# EAGLE design Dual Horizontal Breakout Module (EAGLE 6.1)
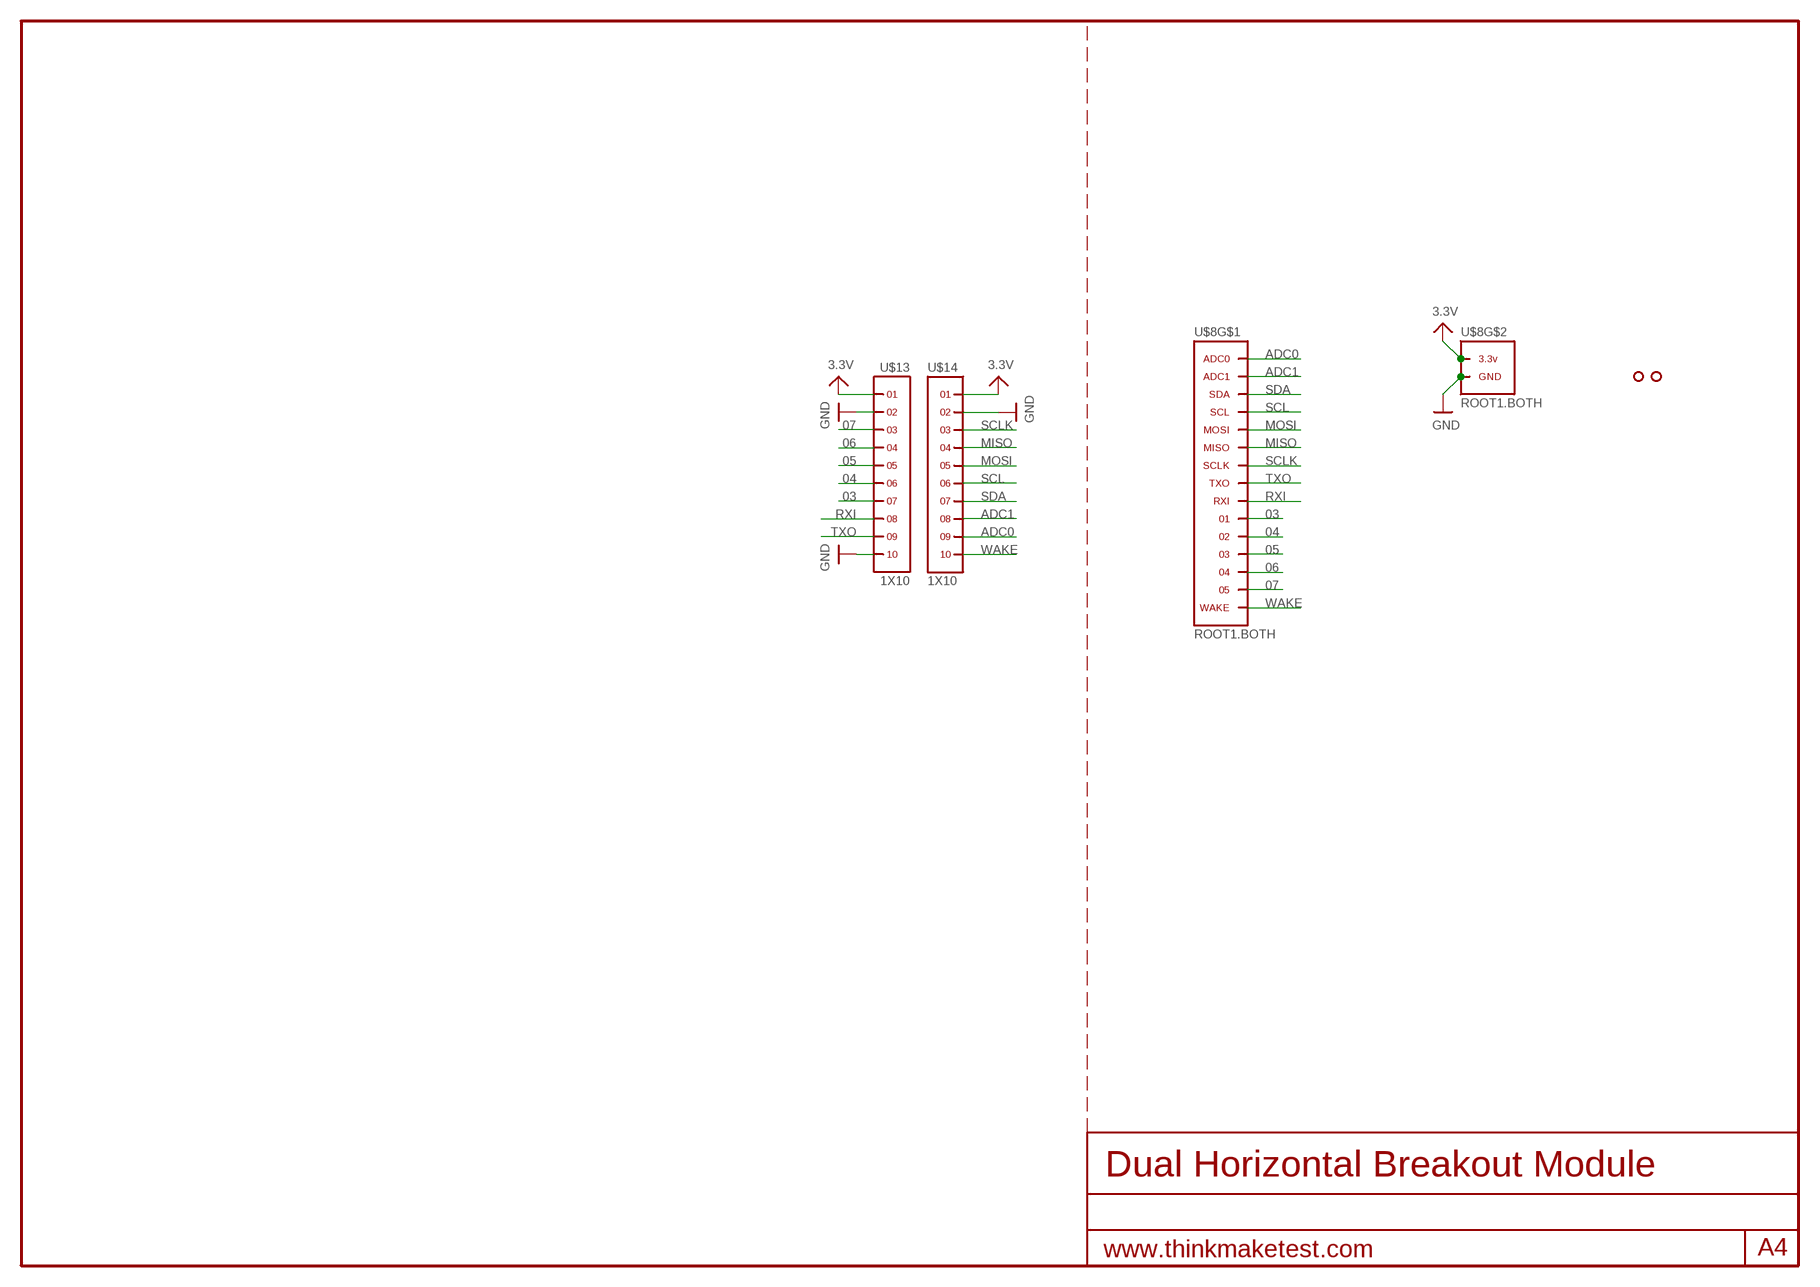
[diagram p0: schematic, sheet 1]

## Parts
U$3  HOLE.2MM  [2MM]
U$4  HOLE.2MM  [2MM]
U$8  ROOT1.BOTH  [ROOT1.BOTH]
U$13  1X10  [1X10]
U$14  1X10  [1X10]

## Nets
03: U$8.03 U$8.03@1 U$8.03@VIA U$13.7
3.3V: U$8.3.3V@1(3.3V) U$8.3.3V@2(3.3V) U$8.3.3V@3(3.3V) U$8.3.3V@4(3.3V) U$8.3.3V@5(3.3V) U$8.3.3V@6(3.3V) U$8.3.3V@7(3.3V) U$8.3.3V@8(3.3V) U$8.3.3V@9(3.3V) U$8.3.3V@10(3.3V) U$8.3.3V@VIA(3.3V) U$13.1 U$14.1
04: U$8.04 U$8.04@1 U$8.04@VIA U$13.6
05: U$8.05 U$8.05@1 U$8.05@VIA U$13.5
06: U$8.06 U$8.06@1 U$8.06@VIA U$13.4
07: U$8.07 U$8.07@1 U$8.07@VIA U$13.3
ADC0: U$8.ADC0 U$8.ADC0@1(ADC0) U$8.ADC0@VIA(ADC0) U$14.9
ADC1: U$8.ADC1 U$8.ADC1@1(ADC1) U$8.ADC1@VIA(ADC1) U$14.8
GND: U$8.GND@1(GND) U$8.GND@2(GND) U$8.GND@3(GND) U$8.GND@4(GND) U$8.GND@5(GND) U$8.GND@6(GND) U$8.GND@7(GND) U$8.GND@8(GND) U$8.GND@9(GND) U$8.GND@10(GND) U$8.GND@11(GND) U$8.GND@12(GND) U$8.GND@13(GND) U$8.GND@14(GND) U$8.GND@15(GND) U$8.GND@16(GND) U$8.GND@17(GND) U$8.GND@18(GND) U$8.GND@19(GND) U$8.GND@20(GND) U$8.GND@VIA(GND) U$13.2 U$13.10 U$14.2
MISO: U$8.MISO U$8.MISO@1(MISO) U$8.MISO@VIA(MISO) U$14.4
MOSI: U$8.MOSI U$8.MOSI@1(MOSI) U$8.MOSI@VIA(MOSI) U$14.5
RXI: U$8.02(RXI) U$8.02@1(RXI) U$8.02@VIA(RXI) U$13.8
SCL: U$8.SCL U$8.SCL@1(SCL) U$8.SCL@VIA(SCL) U$14.6
SCLK: U$8.SCLK U$8.SCLK@1(SCLK) U$8.SCLK@VIA(SCLK) U$14.3
SDA: U$8.SDA U$8.SDA@1(SDA) U$8.SDA@VIA(SDA) U$14.7
TXO: U$8.01(TXO) U$8.01@1(TXO) U$8.01@VIA(TXO) U$13.9
WAKE: U$8.WAKE U$8.WAKE@1(WAKE) U$8.WAKE@VIA(WAKE) U$14.10

## Library data of the parts
U$3 U$4 = .screw_holes:HOLE
U$8 = thinkmaketest:ROOT1
U$13 U$14 = .headers(.1in):1X10

## Board
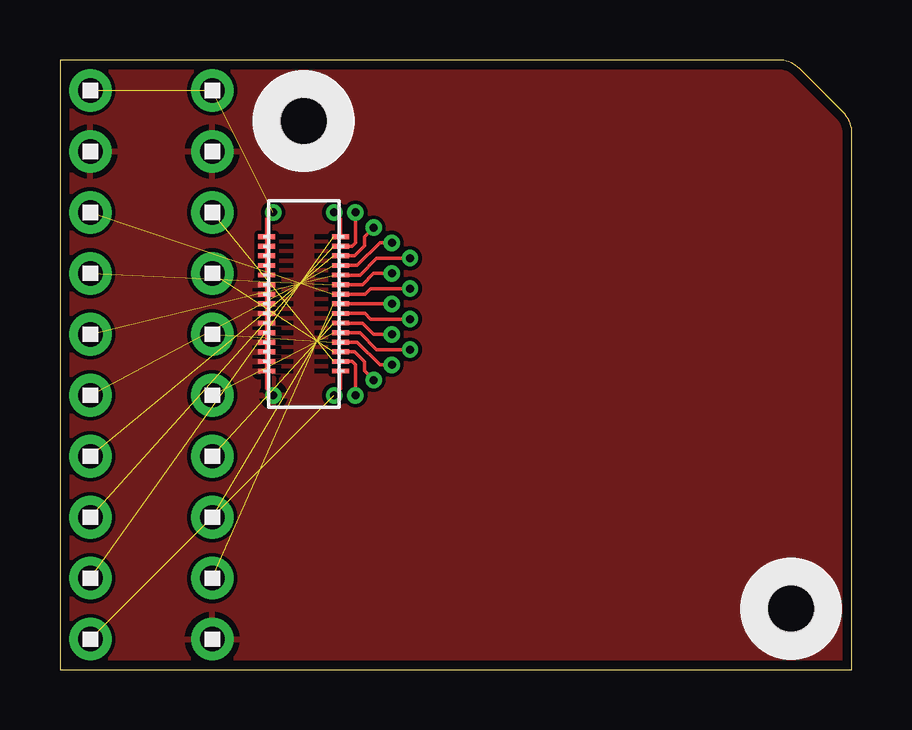
[diagram p1: board, top side]
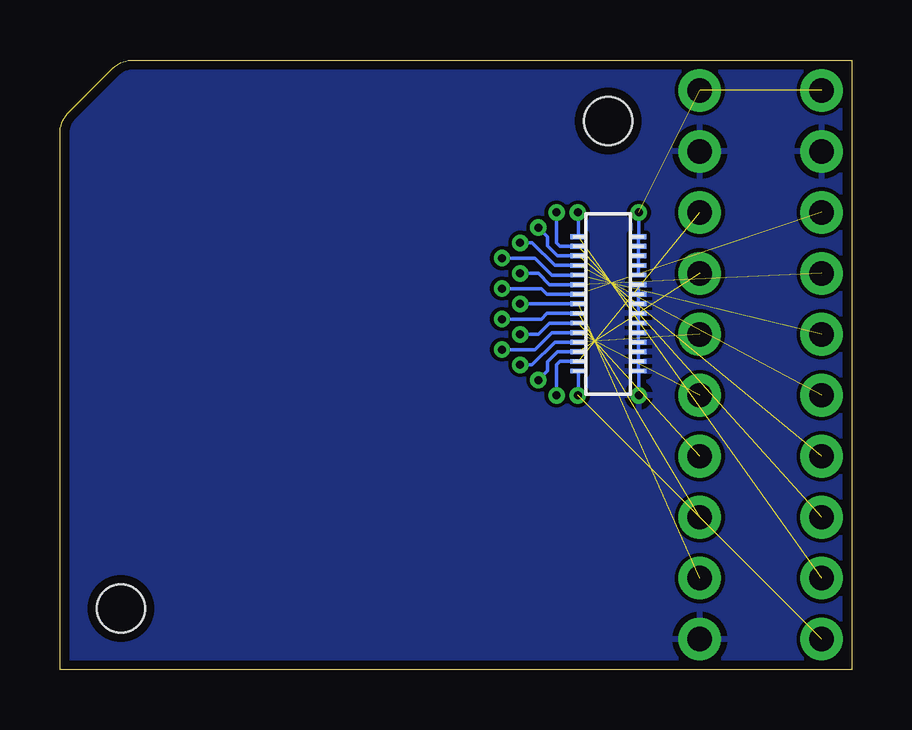
[diagram p2: board, bottom side, seen from below]

Size 33.02 x 25.4 mm. Coordinates in mm from the lower left corner, seen from the top.
Outline: 29.95,25.4 0,25.4 0,0 33.02,0 33.02,22.33 arc45 32.65,23.23 30.85,25.03 arc45 29.95,25.4
Copper layers (1*16): Top 0.0356mm / dielectric 1.5011mm / Bottom 0.0356mm
Design rules: minimum track width 6mil, minimum drill 13mil, track to track 6mil, track to pad 6mil, pad to pad 6mil, via to via 6mil, smd to smd 6mil, copper to edge 15mil, drill to drill 6mil, minimum pad ring 7mil, minimum via ring 7mil, stop-mask expansion 4mil, vias tented up to drill 16mil, thermal gap 10mil

### Footprints (pad centres in the part's own frame; a part is rotated, then mirrored left to right if it is on the bottom)
2MM = hole 2: 0,0
ROOT1.BOTH = smd 0.7 x 0.2: 01 4.08,15.24; 02 4.08,14.84; 03 4.08,14.44; 3.3V@1 1,18.04; 3.3V@2 1,17.64; 3.3V@3 1,17.24; 3.3V@4 1,16.84; 3.3V@5 1,16.44; 04 4.08,14.04; 05 4.08,13.64; 06 4.08,13.24; 07 4.08,12.84; ADC0 4.08,18.04; ADC1 4.08,17.64; GND@1 1,16.04; GND@2 1,15.64; GND@3 1,15.24; GND@4 1,14.84; GND@5 1,14.44; GND@6 1,14.04; GND@7 1,13.64; GND@8 1,13.24; GND@9 1,12.84; GND@10 1,12.44; MISO 4.08,16.04; MOSI 4.08,16.44; SCL 4.08,16.84; SCLK 4.08,15.64; SDA 4.08,17.24; WAKE 4.08,12.44 | smd 0.66 x 0.2 bottom: 01@1 3.795,15.24; 02@1 3.795,14.84; 3.3V@6 1.285,16.44; 3.3V@7 1.285,16.84; 3.3V@8 1.285,17.24; 3.3V@9 1.285,17.64; 3.3V@10 1.285,18.04; 03@1 3.795,14.44; 04@1 3.795,14.04; 05@1 3.795,13.64; 06@1 3.795,13.24; 07@1 3.795,12.84; ADC0@1 3.795,18.04; ADC1@1 3.795,17.64; GND@11 1.285,12.44; GND@12 1.285,12.84; GND@13 1.285,13.24; GND@14 1.285,13.64; GND@15 1.285,14.04; GND@16 1.285,14.44; GND@17 1.285,14.84; GND@18 1.285,15.24; GND@19 1.285,15.64; GND@20 1.285,16.04; MISO@1 3.795,16.04; MOSI@1 3.795,16.44; SCL@1 3.795,16.84; SCLK@1 3.795,15.64; SDA@1 3.795,17.24; WAKE@1 3.795,12.44 | drill 0.33 pad 0.686: 01@VIA 6.215,15.24; 02@VIA 6.973,14.605; 3.3V@VIA 1.27,19.05; 03@VIA 6.215,13.97; 04@VIA 6.973,13.335; 05@VIA 6.215,12.7; 06@VIA 5.457,12.065; 07@VIA 4.699,11.43; ADC0@VIA 3.81,19.05; ADC1@VIA 4.699,19.05; GND@VIA 1.27,11.43; MISO@VIA 6.215,16.51; MOSI@VIA 6.973,17.145; SCL@VIA 6.215,17.78; SCLK@VIA 6.973,15.875; SDA@VIA 5.457,18.415; WAKE@VIA 3.81,11.43
1X10 = drill 1.016 pad 1.778: 1 0,0; 2 2.54,0; 3 5.08,0; 4 7.62,0; 5 10.16,0; 6 12.7,0; 7 15.24,0; 8 17.78,0; 9 20.32,0; 10 22.86,0

### Placement (x,y rotation side)
U$3  30.48,2.54 90 top
U$4  10.16,22.86 90 top
U$8  7.62,0 0 top
U$13  6.35,24.13 270 top
U$14  1.27,24.13 270 top

### Tracks (layer width: path | path; a pad name or v marks a point on that pad's centre or on a via)
03  (1 unrouted)
3.3V  (2 unrouted)
04  (1 unrouted)
05  (1 unrouted)
06  (1 unrouted)
07  (1 unrouted)
ADC0  (1 unrouted)
ADC1  (1 unrouted)
GND
  pour Bottom: 0,0 33.02,0 33.02,25.4 0,25.4
  pour Top: 0,0 33.02,0 33.02,25.4 0,25.4
MISO  (1 unrouted)
MOSI  (1 unrouted)
RXI  (1 unrouted)
SCL  (1 unrouted)
SCLK  (1 unrouted)
SDA  (1 unrouted)
TXO  (1 unrouted)
WAKE  (1 unrouted)